# Altium schematic sheet mcu0_primary.SchDoc: foxBMS BMS-Master
size A3; DocumentNumber: 4; SheetNumber: 4; SheetTotal: 24; Author: Fraunhofer IISB foxBMS Team; REL-DATE: 2017-05-16; VERSION: 1.0.2; SheetDescription: MCU0 (Primary); ClassName: ISO_MCU
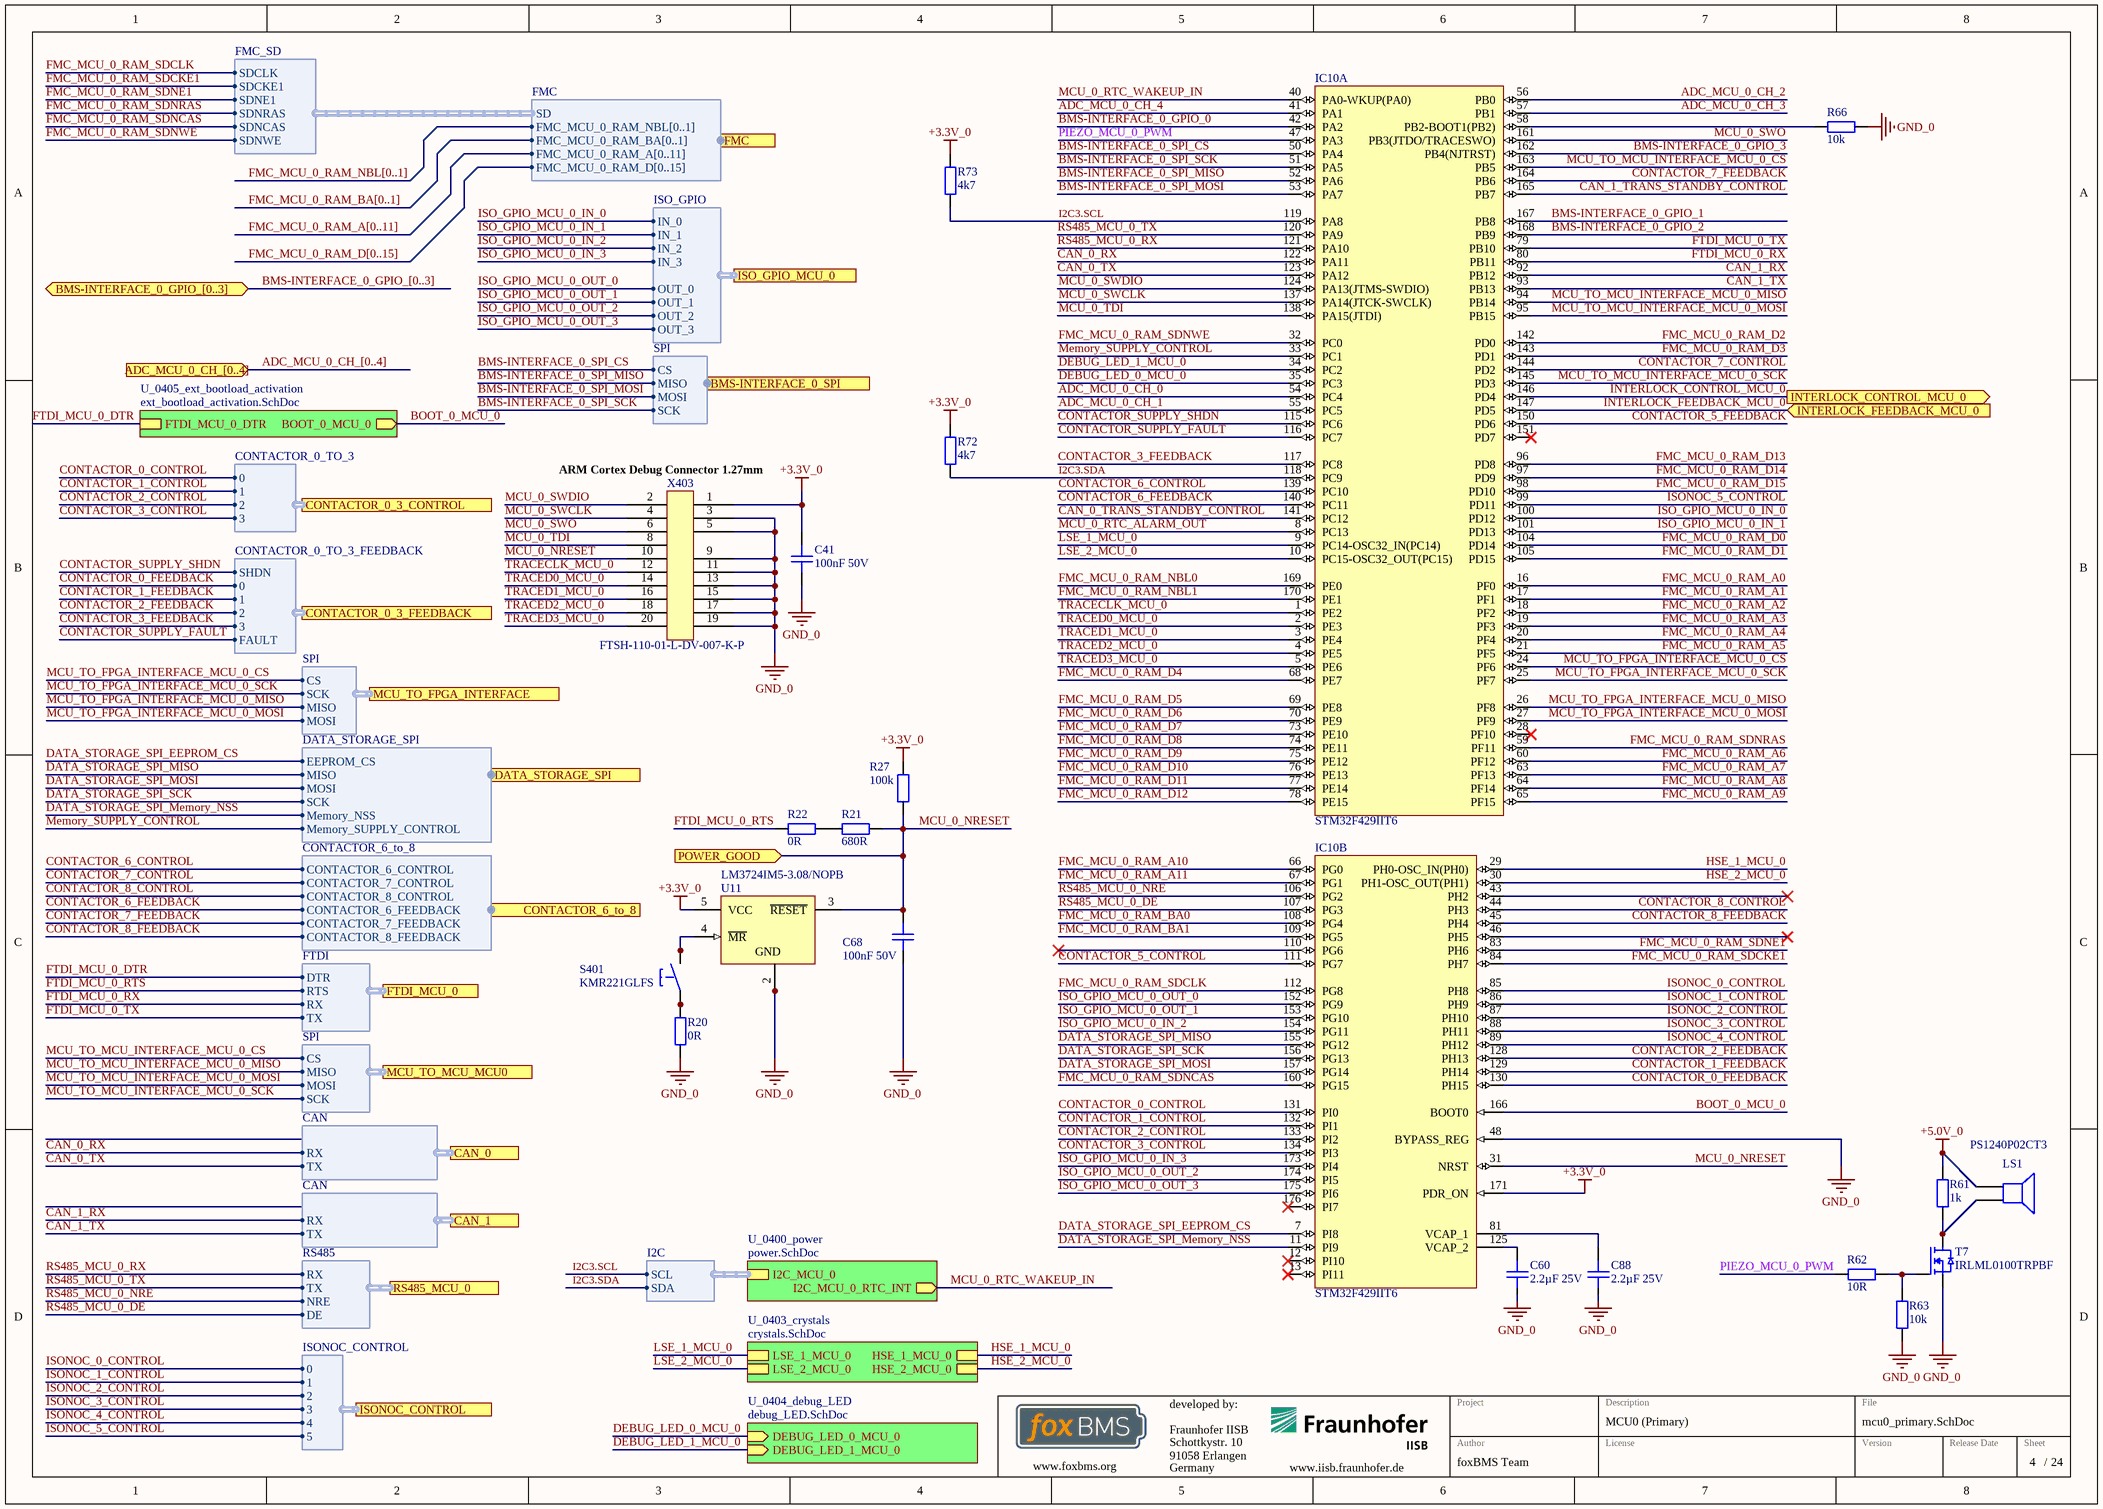
[diagram p0: mcu0_primary.SchDoc]

## Parts
C41  100nF 50V  [0603C]
C60  2.2µF 25V  [0805C]
C68  100nF 50V  [0603C]
C88  2.2µF 25V  [0805C]
IC10  STM32F429IIT6  [STM-LQFP176_N]  (parts A,B of 3)
LS1  PS1240P02CT3  [PS12]
R20  0R  [0603R]
R21  680R  [0603R]
R22  0R  [0603R]
R27  100k  [0603R]
R61  1k  [0603R]
R62  10R  [0603R]
R63  10k  [0603R]
R66  10k  [0603R]
R72  4k7  [0603R]
R73  4k7  [0603R]
S401  KMR221GLFS  [KMR2_Series]
T7  IRLML0100TRPBF  [SOT95P237X110-3N]
U11  LM3724IM5-3.08/NOPB  [MF05A_N]
X403  FTSH-110-01-L-DV-007-K-P  [CORTEX_DEBUG_20_PIN]

## Sub-sheets
U_0400_power = power.SchDoc: I2C_MCU_0_RTC_INT (out), I2C_MCU_0 (harness I2C)
U_0403_crystals = crystals.SchDoc: LSE_1_MCU_0, LSE_2_MCU_0, HSE_1_MCU_0, HSE_2_MCU_0
U_0404_debug_LED = debug_LED.SchDoc: DEBUG_LED_0_MCU_0 (in), DEBUG_LED_1_MCU_0 (in)
U_0405_ext_bootload_activation = ext_bootload_activation.SchDoc: FTDI_MCU_0_DTR, BOOT_0_MCU_0 (out)

## Ports
ADC_MCU_0_CH_[0..4] (in), BMS-INTERFACE_0_GPIO_[0..3] (bidir, harness CAN), BMS-INTERFACE_0_SPI (harness SPI), CAN_0 (harness CAN), CAN_1 (harness CAN), CONTACTOR_0_3_CONTROL (harness CONTACTOR_0_TO_3), CONTACTOR_0_3_FEEDBACK (harness CONTACTOR_0_TO_3_FEEDBACK), CONTACTOR_6_to_8 (harness CONTACTOR_6_to_8), DATA_STORAGE_SPI (harness DATA_STORAGE_SPI), FMC (harness FMC), FTDI_MCU_0 (harness FTDI), INTERLOCK_CONTROL_MCU_0 (out), INTERLOCK_FEEDBACK_MCU_0 (in), ISO_GPIO_MCU_0 (harness ISO_GPIO), ISONOC_CONTROL (harness ISONOC_CONTROL), MCU_TO_FPGA_INTERFACE (harness SPI), MCU_TO_MCU_MCU0 (harness SPI), POWER_GOOD (in), RS485_MCU_0 (harness RS485)

## Harnesses
FMC_SD: SDCLK, SDCKE1, SDNE1, SDNRAS, SDNWE, SDNCAS
FMC: SD, FMC_MCU_0_RAM_NBL[0..1], FMC_MCU_0_RAM_BA[0..1], FMC_MCU_0_RAM_A[0..11], FMC_MCU_0_RAM_D[0..15]
SPI: CS, SCK, MISO, MOSI
DATA_STORAGE_SPI: EEPROM_CS, MISO, MOSI, SCK, Memory_NSS, Memory_SUPPLY_CONTROL
CONTACTOR_6_to_8: CONTACTOR_6_CONTROL, CONTACTOR_7_CONTROL, CONTACTOR_8_CONTROL, CONTACTOR_6_FEEDBACK, CONTACTOR_7_FEEDBACK, CONTACTOR_8_FEEDBACK
SPI: CS, MISO, MOSI, SCK
FTDI: DTR, RTS, RX, TX
CAN: RX, TX
RS485: RX, TX, NRE, DE
ISONOC_CONTROL: 0, 1, 2, 3, 4, 5
ISO_GPIO: IN_0, IN_1, IN_2, IN_3, OUT_3, OUT_0, OUT_1, OUT_2
CONTACTOR_0_TO_3: 0, 1, 2, 3
CONTACTOR_0_TO_3_FEEDBACK: 0, 1, 2, 3, FAULT, SHDN
I2C: SDA, SCL

## Nets
+3.3V_0: C41.1 IC10.171(PDR_ON) R27.2 R72.2 R73.2 U11.5(VCC) X403.1
+5.0V_0: LS1.1 R61.2
GND_0: C41.2 C60.2 C68.2 C88.2 IC10.48(BYPASS_REG) R20.1 R63.1 R66.1 T7.S U11.1(GND) U11.2(GND) X403.3 X403.5 X403.9 X403.11 X403.13 X403.15 X403.17 X403.19
ADC_MCU_0_CH_0: IC10.54(PC4)
ADC_MCU_0_CH_1: IC10.55(PC5)
ADC_MCU_0_CH_2: IC10.56(PB0)
ADC_MCU_0_CH_3: IC10.57(PB1)
ADC_MCU_0_CH_4: IC10.41(PA1)
BMS-INTERFACE_0_GPIO_0: IC10.42(PA2)
BMS-INTERFACE_0_GPIO_1: IC10.167(PB8)
BMS-INTERFACE_0_GPIO_2: IC10.168(PB9)
BMS-INTERFACE_0_GPIO_3: IC10.162(PB4(NJTRST))
BMS-INTERFACE_0_SPI_CS: IC10.50(PA4) ; port BMS-INTERFACE_0_SPI.CS
BMS-INTERFACE_0_SPI_MISO: IC10.52(PA6) ; port BMS-INTERFACE_0_SPI.MISO
BMS-INTERFACE_0_SPI_MOSI: IC10.53(PA7) ; port BMS-INTERFACE_0_SPI.MOSI
BMS-INTERFACE_0_SPI_SCK: IC10.51(PA5) ; port BMS-INTERFACE_0_SPI.SCK
BOOT_0_MCU_0: IC10.166(BOOT0) ; sheet U_0405_ext_bootload_activation/BOOT_0_MCU_0
CAN_0_RX: IC10.122(PA11) ; port CAN_0.RX
CAN_0_TRANS_STANDBY_CONTROL: IC10.141(PC12)
CAN_0_TX: IC10.123(PA12) ; port CAN_0.TX
CAN_1_RX: IC10.92(PB12) ; port CAN_1.RX
CAN_1_TRANS_STANDBY_CONTROL: IC10.165(PB7)
CAN_1_TX: IC10.93(PB13) ; port CAN_1.TX
CONTACTOR_0_CONTROL: IC10.131(PI0) ; port CONTACTOR_0_3_CONTROL.0
CONTACTOR_0_FEEDBACK: IC10.130(PH15) ; port CONTACTOR_0_3_FEEDBACK.0
CONTACTOR_1_CONTROL: IC10.132(PI1) ; port CONTACTOR_0_3_CONTROL.1
CONTACTOR_1_FEEDBACK: IC10.129(PH14) ; port CONTACTOR_0_3_FEEDBACK.1
CONTACTOR_2_CONTROL: IC10.133(PI2) ; port CONTACTOR_0_3_CONTROL.2
CONTACTOR_2_FEEDBACK: IC10.128(PH13) ; port CONTACTOR_0_3_FEEDBACK.2
CONTACTOR_3_CONTROL: IC10.134(PI3) ; port CONTACTOR_0_3_CONTROL.3
CONTACTOR_3_FEEDBACK: IC10.117(PC8) ; port CONTACTOR_0_3_FEEDBACK.3
CONTACTOR_5_CONTROL: IC10.111(PG7)
CONTACTOR_5_FEEDBACK: IC10.150(PD6)
CONTACTOR_6_CONTROL: IC10.139(PC10) ; port CONTACTOR_6_to_8.CONTACTOR_6_CONTROL
CONTACTOR_6_FEEDBACK: IC10.140(PC11) ; port CONTACTOR_6_to_8.CONTACTOR_6_FEEDBACK
CONTACTOR_7_CONTROL: IC10.144(PD2) ; port CONTACTOR_6_to_8.CONTACTOR_7_CONTROL
CONTACTOR_7_FEEDBACK: IC10.164(PB6) ; port CONTACTOR_6_to_8.CONTACTOR_7_FEEDBACK
CONTACTOR_8_CONTROL: IC10.44(PH3) ; port CONTACTOR_6_to_8.CONTACTOR_8_CONTROL
CONTACTOR_8_FEEDBACK: IC10.45(PH4) ; port CONTACTOR_6_to_8.CONTACTOR_8_FEEDBACK
CONTACTOR_SUPPLY_FAULT: IC10.116(PC7) ; port CONTACTOR_0_3_FEEDBACK.FAULT
CONTACTOR_SUPPLY_SHDN: IC10.115(PC6) ; port CONTACTOR_0_3_FEEDBACK.SHDN
DATA_STORAGE_SPI_EEPROM_CS: IC10.7(PI8) ; port DATA_STORAGE_SPI.EEPROM_CS
DATA_STORAGE_SPI_Memory_NSS: IC10.11(PI9) ; port DATA_STORAGE_SPI.Memory_NSS
DATA_STORAGE_SPI_MISO: IC10.155(PG12) ; port DATA_STORAGE_SPI.MISO
DATA_STORAGE_SPI_MOSI: IC10.157(PG14) ; port DATA_STORAGE_SPI.MOSI
DATA_STORAGE_SPI_SCK: IC10.156(PG13) ; port DATA_STORAGE_SPI.SCK
DEBUG_LED_0_MCU_0: IC10.35(PC3) ; sheet U_0404_debug_LED/DEBUG_LED_0_MCU_0
DEBUG_LED_1_MCU_0: IC10.34(PC2) ; sheet U_0404_debug_LED/DEBUG_LED_1_MCU_0
FMC_MCU_0_RAM_A0: IC10.16(PF0)
FMC_MCU_0_RAM_A1: IC10.17(PF1)
FMC_MCU_0_RAM_A2: IC10.18(PF2)
FMC_MCU_0_RAM_A3: IC10.19(PF3)
FMC_MCU_0_RAM_A4: IC10.20(PF4)
FMC_MCU_0_RAM_A5: IC10.21(PF5)
FMC_MCU_0_RAM_A6: IC10.60(PF12)
FMC_MCU_0_RAM_A7: IC10.63(PF13)
FMC_MCU_0_RAM_A8: IC10.64(PF14)
FMC_MCU_0_RAM_A9: IC10.65(PF15)
FMC_MCU_0_RAM_A10: IC10.66(PG0)
FMC_MCU_0_RAM_A11: IC10.67(PG1)
FMC_MCU_0_RAM_BA0: IC10.108(PG4)
FMC_MCU_0_RAM_BA1: IC10.109(PG5)
FMC_MCU_0_RAM_D0: IC10.104(PD14)
FMC_MCU_0_RAM_D1: IC10.105(PD15)
FMC_MCU_0_RAM_D2: IC10.142(PD0)
FMC_MCU_0_RAM_D3: IC10.143(PD1)
FMC_MCU_0_RAM_D4: IC10.68(PE7)
FMC_MCU_0_RAM_D5: IC10.69(PE8)
FMC_MCU_0_RAM_D6: IC10.70(PE9)
FMC_MCU_0_RAM_D7: IC10.73(PE10)
FMC_MCU_0_RAM_D8: IC10.74(PE11)
FMC_MCU_0_RAM_D9: IC10.75(PE12)
FMC_MCU_0_RAM_D10: IC10.76(PE13)
FMC_MCU_0_RAM_D11: IC10.77(PE14)
FMC_MCU_0_RAM_D12: IC10.78(PE15)
FMC_MCU_0_RAM_D13: IC10.96(PD8)
FMC_MCU_0_RAM_D14: IC10.97(PD9)
FMC_MCU_0_RAM_D15: IC10.98(PD10)
FMC_MCU_0_RAM_NBL0: IC10.169(PE0)
FMC_MCU_0_RAM_NBL1: IC10.170(PE1)
FMC_MCU_0_RAM_SDCKE1: IC10.84(PH7) ; harness FMC_SD.SDCKE1
FMC_MCU_0_RAM_SDCLK: IC10.112(PG8) ; harness FMC_SD.SDCLK
FMC_MCU_0_RAM_SDNCAS: IC10.160(PG15) ; harness FMC_SD.SDNCAS
FMC_MCU_0_RAM_SDNE1: IC10.83(PH6) ; harness FMC_SD.SDNE1
FMC_MCU_0_RAM_SDNRAS: IC10.59(PF11) ; harness FMC_SD.SDNRAS
FMC_MCU_0_RAM_SDNWE: IC10.32(PC0) ; harness FMC_SD.SDNWE
FTDI_MCU_0_DTR: sheet U_0405_ext_bootload_activation/FTDI_MCU_0_DTR, port FTDI_MCU_0.DTR
FTDI_MCU_0_RTS: R22.2 ; port FTDI_MCU_0.RTS
FTDI_MCU_0_RX: IC10.80(PB11) ; port FTDI_MCU_0.RX
FTDI_MCU_0_TX: IC10.79(PB10) ; port FTDI_MCU_0.TX
HSE_1_MCU_0: IC10.29(PH0-OSC_IN(PH0)) ; sheet U_0403_crystals/HSE_1_MCU_0
HSE_2_MCU_0: IC10.30(PH1-OSC_OUT(PH1)) ; sheet U_0403_crystals/HSE_2_MCU_0
I2C3.SCL: IC10.119(PA8) R73.1 ; sheet U_0400_power/I2C_MCU_0.SCL
I2C3.SDA: IC10.118(PC9) R72.1 ; sheet U_0400_power/I2C_MCU_0.SDA
INTERLOCK_CONTROL_MCU_0: IC10.146(PD4) ; port INTERLOCK_CONTROL_MCU_0
INTERLOCK_FEEDBACK_MCU_0: IC10.147(PD5) ; port INTERLOCK_FEEDBACK_MCU_0
ISO_GPIO_MCU_0_IN_0: IC10.100(PD12) ; port ISO_GPIO_MCU_0.IN_0
ISO_GPIO_MCU_0_IN_1: IC10.101(PD13) ; port ISO_GPIO_MCU_0.IN_1
ISO_GPIO_MCU_0_IN_2: IC10.154(PG11) ; port ISO_GPIO_MCU_0.IN_2
ISO_GPIO_MCU_0_IN_3: IC10.173(PI4) ; port ISO_GPIO_MCU_0.IN_3
ISO_GPIO_MCU_0_OUT_0: IC10.152(PG9) ; port ISO_GPIO_MCU_0.OUT_0
ISO_GPIO_MCU_0_OUT_1: IC10.153(PG10) ; port ISO_GPIO_MCU_0.OUT_1
ISO_GPIO_MCU_0_OUT_2: IC10.174(PI5) ; port ISO_GPIO_MCU_0.OUT_2
ISO_GPIO_MCU_0_OUT_3: IC10.175(PI6) ; port ISO_GPIO_MCU_0.OUT_3
ISONOC_0_CONTROL: IC10.85(PH8) ; port ISONOC_CONTROL.0
ISONOC_1_CONTROL: IC10.86(PH9) ; port ISONOC_CONTROL.1
ISONOC_2_CONTROL: IC10.87(PH10) ; port ISONOC_CONTROL.2
ISONOC_3_CONTROL: IC10.88(PH11) ; port ISONOC_CONTROL.3
ISONOC_4_CONTROL: IC10.89(PH12) ; port ISONOC_CONTROL.4
ISONOC_5_CONTROL: IC10.99(PD11) ; port ISONOC_CONTROL.5
LSE_1_MCU_0: IC10.9(PC14-OSC32_IN(PC14)) ; sheet U_0403_crystals/LSE_1_MCU_0
LSE_2_MCU_0: IC10.10(PC15-OSC32_OUT(PC15)) ; sheet U_0403_crystals/LSE_2_MCU_0
MCU_0_NRESET: C68.1 IC10.31(NRST) R21.1 R27.1 U11.3(~{RESET}) X403.10 ; port POWER_GOOD
MCU_0_RTC_ALARM_OUT: IC10.8(PC13)
MCU_0_RTC_WAKEUP_IN: IC10.40(PA0-WKUP(PA0)) ; sheet U_0400_power/I2C_MCU_0_RTC_INT
MCU_0_SWCLK: IC10.137(PA14(JTCK-SWCLK)) X403.4
MCU_0_SWDIO: IC10.124(PA13(JTMS-SWDIO)) X403.2
MCU_0_SWO: IC10.161(PB3(JTDO/TRACESWO)) X403.6
MCU_0_TDI: IC10.138(PA15(JTDI)) X403.8
MCU_TO_FPGA_INTERFACE_MCU_0_CS: IC10.24(PF6) ; port MCU_TO_FPGA_INTERFACE.CS
MCU_TO_FPGA_INTERFACE_MCU_0_MISO: IC10.26(PF8) ; port MCU_TO_FPGA_INTERFACE.MISO
MCU_TO_FPGA_INTERFACE_MCU_0_MOSI: IC10.27(PF9) ; port MCU_TO_FPGA_INTERFACE.MOSI
MCU_TO_FPGA_INTERFACE_MCU_0_SCK: IC10.25(PF7) ; port MCU_TO_FPGA_INTERFACE.SCK
MCU_TO_MCU_INTERFACE_MCU_0_CS: IC10.163(PB5) ; port MCU_TO_MCU_MCU0.CS
MCU_TO_MCU_INTERFACE_MCU_0_MISO: IC10.94(PB14) ; port MCU_TO_MCU_MCU0.MISO
MCU_TO_MCU_INTERFACE_MCU_0_MOSI: IC10.95(PB15) ; port MCU_TO_MCU_MCU0.MOSI
MCU_TO_MCU_INTERFACE_MCU_0_SCK: IC10.145(PD3) ; port MCU_TO_MCU_MCU0.SCK
Memory_SUPPLY_CONTROL: IC10.33(PC1) ; port DATA_STORAGE_SPI.Memory_SUPPLY_CONTROL
PIEZO_MCU_0_PWM: IC10.47(PA3) R62.2
RS485_MCU_0_DE: IC10.107(PG3) ; port RS485_MCU_0.DE
RS485_MCU_0_NRE: IC10.106(PG2) ; port RS485_MCU_0.NRE
RS485_MCU_0_RX: IC10.121(PA10) ; port RS485_MCU_0.RX
RS485_MCU_0_TX: IC10.120(PA9) ; port RS485_MCU_0.TX
TRACECLK_MCU_0: IC10.1(PE2) X403.12
TRACED0_MCU_0: IC10.2(PE3) X403.14
TRACED1_MCU_0: IC10.3(PE4) X403.16
TRACED2_MCU_0: IC10.4(PE5) X403.18
TRACED3_MCU_0: IC10.5(PE6) X403.20
NetC60_1: C60.1 IC10.125(VCAP_2)
NetC88_1: C88.1 IC10.81(VCAP_1)
NetIC10_58: IC10.58(PB2-BOOT1(PB2)) R66.2
NetLS1_2: LS1.2 R61.1 T7.D
NetR20_2: R20.2 S401.1 S401.2
NetR21_2: R21.2 R22.1
NetR62_1: R62.1 R63.2 T7.G
NetS401_3: S401.3 S401.4 U11.4(~{MR})

Not connected (* = marked no-connect by the designer): IC10 12(PI10)* 13(PI11)* 28(PF10)* 43(PH2)* 46(PH5)* 110(PG6)* 151(PD7)* 176(PI7)*

## Buses and harness runs
bus ADC_MCU_0_CH_[0..4] = port ADC_MCU_0_CH_[0..4]
bus BMS-INTERFACE_0_GPIO_[0..3]
bus FMC_MCU_0_RAM_A[0..11]
bus FMC_MCU_0_RAM_BA[0..1]
bus FMC_MCU_0_RAM_D[0..15]
bus FMC_MCU_0_RAM_NBL[0..1]

## Notes on the sheet
- (near X403) ARM Cortex Debug Connector 1.27mm
- Fraunhofer IISB
- Schottkystr. 10
- developed by:
- 91058 Erlangen
- Germany
- Author
- Project
- License
- Description
- File
- Version
- Release Date
- Sheet
- www.foxbms.org
- www.iisb.fraunhofer.de
- foxBMS Team
- /

## Library data of the parts
C41 C68 = gen_C_ceramic_100n_50V_X7R_0603: Ceramic, 100nF, ±10%, 50V, X7R, –55 to 125°C, 0603 (1608),RoHS, Automotive; Part Number: GCJ188R71H104KA12; Manufacturer: Murata; Capacitance: 100n; Case EIA: 0603; Case Metric: 1608; PnP Package: C_0603_10; PnP Value: 100nF/50V/X7R; PnP equipped: x; Automotive Qualified: True; Rated Voltage: 50V; Dielectric: X7R; Supplier 1: Digi-Key; Supplier Part Number 1: 490-5798-1-ND; Height - Seated (Max): 0.8mm; Mounting Type: SurfaceMount,MLCC; Operating Temperature: –55 to 125°C; Series: GCJ; Tolerance: ±10%; Manufacturer_Part_Number: GCJ188R71H104KA12
C60 C88 = gen_C_ceramic_2u2_50V_X7R_0805: Ceramic, 2.2µF, ±10%, 25V, X7R, –55 to 125°C, 0805 (2012),RoHS, Automotive; Part Number: GCJ21BR71E225KA01; Manufacturer: Murata; Capacitance: 2u2; Case EIA: 0805; Case Metric: 2012; Automotive Qualified: True; PnP Package: C_0805_10; PnP Value: 2.2µF/25V/X7R; Rated Voltage: 25V; Dielectric: X7R; Height - Seated (Max): 1.25mm; Mounting Type: SurfaceMount,MLCC; Operating Temperature: –55 to 125°C; Series: GCJ; Tolerance: ±10%; Manufacturer_Part_Number: GCJ21BR71E225KA01
IC10 = MC-ARM-STM32F4X9-SQ176: ARM Cortex-M4 32-bit MCU+FPU, 225 DMIPS, 2048 kB Flash, 256 kB Internal RAM, 140 I/Os, 176-pin LQFP, -40 to 85 degC, Tray; Manufacturer: STMicroelectronics; Internal RAM Size (kB): 256; I/Os (High Current): 140; FLASH Size (Prog) (kB): 2048; D/A Converter: 2x12-bit; Supply Voltage(Vcc) max (V): 3.6; Operating Frequency(F) (Processor speed) (MHz): 180; Supply Voltage(Vcc) min (V): 1.8; Core: ARM Cortex-M4; PackageReference: LQFP176; ComponentLink1Description: Manufacturer URL; Packing: Tray; ComponentLink2Description: Datasheet; ComponentLink3Description: Package Specification; ComponentLink2URL: http://www.st.com/st-web-ui/static/active/en/resource/technical/document/data_brief/DM00053488.pdf; PackageVersion: Rev. 4, 06/2013; ComponentLink1URL: http://www.st.com/web/en/home.html; DatasheetVersion: Rev. 2; PartNumber: STM32F429IIT6; PackageDescription: 176-Pin Low Profile Quad Flat Package, 24 x 24 mm Body, 0.5 mm Pitch; ComponentLink3URL: http://www.st.com/st-web-ui/static/active/en/resource/technical/document/datasheet/DM00035129.pdf; Mounting Technology: Surface Mount; Part Number: STM32F429IIT6
LS1 = Speaker: Loudspeaker; ID: 17009; DBDesc: BUZZER PIEZO 4KHZ 12.2MM PC MNT, RoHS compliant
R20 R22 = gen_R_0R_0603: SMD Resistor 0R 0603; Power: 0.1W; Case EIA: 0603; Case Metric: 1608; PnP Package: R_0603; Maximum Working Voltage: 75V; Automotive Qualified: False; Part Number: gen_R_0R_0603; Operating Temperature: -55°C - +155°C; Resistance: 0R; Series: Jumper; PnP Value: 0R; Supplier 1: Farnell; Supplier Part Number 1: 2073345
R21 = gen_R_680R_0603: SMD Resistor 680R 0603; Tolerance: 1%; Power: 0.1W; Case EIA: 0603; Case Metric: 1608; Maximum Working Voltage: 75V; PnP Package: R_0603; Automotive Qualified: False; Part Number: gen_R_680R_0603; Operating Temperature: -55°C - +155°C; Resistance: 680R; Series: E24; PnP Value: 680R; Supplier 1: Farnell; Supplier Part Number 1: 2797303
R27 = gen_R_100k_0603: SMD Resistor 100k 0603; Case EIA: 0603; Case Metric: 1608; PnP Package: R_0603; Automotive Qualified: False; Part Number: gen_R_100k_0603; Operating Temperature: -55°C - +155°C; PnP Value: 100k
R61 = gen_R_10k_0603: SMD Resistor 1k 0603; Part Number: gen_R_1k_0603; Tolerance: 1%; Power: 0.1W; Case EIA: 0603; Case Metric: 1608; Maximum Working Voltage: 75V; PnP Package: R_0603; Automotive Qualified: False; Operating Temperature: -55°C - +155°C; Resistance: 1k; Series: E24, E96; PnP Value: 1k
R62 = gen_R_10R_0603: SMD Resistor 10R 0603; Tolerance: 1%; Power: 0.1W; Case EIA: 0603; Case Metric: 1608; Maximum Working Voltage: 75V; PnP Package: R_0603; Automotive Qualified: False; Part Number: gen_R_10R_0603; Operating Temperature: -55°C - +155°C; Resistance: 10R; Series: E24, E96; PnP Value: 10R; Supplier 1: Farnell; Supplier Part Number 1: 2073361
R63 R66 = gen_R_10k_0603: SMD Resistor 10k 0603; Tolerance: 1%; Power: 0.1W; Case EIA: 0603; Case Metric: 1608; Maximum Working Voltage: 75V; PnP Package: R_0603; Automotive Qualified: False; Part Number: gen_R_10k_0603; Operating Temperature: -55°C - +155°C; Resistance: 10k; Series: E24, E96; PnP Value: 10k; Supplier 1: Farnell; Supplier Part Number 1: 2073349
R72 R73 = gen_R_4K7_0603: SMD Resistor 4.7k 0603; Case EIA: 0603; Case Metric: 1608; PnP Package: R_0603; Automotive Qualified: False; PnP Value: 4k7; Operating Temperature: -55°C - +155°C; Part Number: gen_R_4k7_0603
S401 = KMR221GLFS: Microminiature Tactile Switch; Manufacturer: CK Components; Automotive Qualified: False; Part Number: KMR221GLFS; Operating Temperature: -40°C - +85°C; ComponentLink1Description: Datasheet; ComponentLink1URL: http://www.farnell.com/datasheets/1685525.pdf; Supplier 1: Farnell; Supplier Part Number 1: 1201424; Supplier 2: Digikey; Supplier Part Number 2: 401-1426-1-ND; Supplier 3: Mouser; Supplier Part Number 3: 611-KMR211G-LFS
T7 = IRLML0100TRPBF: MOSFET-Transistor, n-Kanal, 1.6 A, 100 V, 0.178 ohm, 10 V, 2.5 V; Manufacturer: Infineon; Maximum Drain-Source Voltage: 100V; Maximum Continous Drain Current (25°C): 1.6A; R_DS(on): 190m; Total Gate Charge: 2.5nC; Automotive Qualified: False; Part Number: IRLML0100TRPBF; Part Name: NMOS; Operating Temperature: -55°C - +150°C; ComponentLink1Description: Datasheet URL; ComponentLink1URL: http://www.farnell.com/datasheets/491501.pdf; Supplier 1: Farnell; Supplier Part Number 1: 1783928
U11 = CMP-0063-01088-2: 5-Pin Microprocessor Reset Circuits, 5-pin SOT-23, Pb-Free; Manufacturer: National Semiconductor; PowerWise: N; PackageTopMarking: R53B*XTT; CompType: MiscPower; PackageVersion: revD, Aug-2008; ComponentLink3URL: http://www.national.com/packaging/folders/mf05a.html; ComponentLink2URL: http://www.national.com/pf/LM/LM3724.html; PinCount: 5; ComponentLink2Description: LM3724 Web Page; PackageDescription: Molded SOT-23, .115 x .063 x .040 in Body, 5 Lead, .0375 in Pitch; ComponentLink3Description: MF05A Package Page; ComponentLink1Description: LM3724 Datasheet; RevisionNote: Component URLs added; RoHS: Y; ComponentLink1URL: http://www.national.com/ds/LM/LM3724.pdf; DatasheetVersion: Jul-2007; PackageReference: MF05A
X403 = samtec_FTSH-110-01-L-DV-007-K-P: Board-To-Board Connector, ARM Cortex Debug Header 20 Pin; Manufacturer: Samtec; Circuits: 20; Automotive Qualified: False; Part Number: samtec_FTSH-110-01-L-DV-007-K-P; Part Name: FTSH-110-01-L-DV-007-K-P; Operating Temperature: -55°C - +125°C; Supplier 1: Digikey; Supplier Part Number 1: SAM11268-ND; Supplier 2: Avnet; Supplier Part Number 2: FTSH-110-01-L-DV-007-K-P